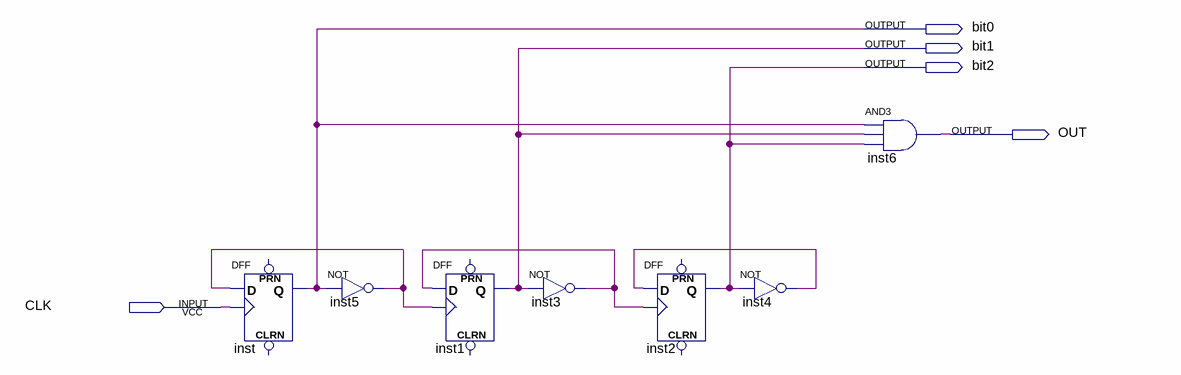
[diagram p0: schematic sheet]
// Quartus schematic Modulo8_Asyn_Counter.bdf as structural Verilog: 7 symbols, 5 pins
module Modulo8_Asyn_Counter (
  input  CLK,
  output bit0,
  output bit1,
  output bit2,
  output OUT
);

  wire inst3_out, inst4_out, inst5_out;

  DFF inst (.CLK(CLK), .D(inst5_out), .Q(bit0));  // open: CLRN, PRN
  not inst5 (inst5_out, bit0);
  DFF inst1 (.CLK(inst5_out), .D(inst3_out), .Q(bit1));  // open: CLRN, PRN
  not inst3 (inst3_out, bit1);
  DFF inst2 (.CLK(inst3_out), .D(inst4_out), .Q(bit2));  // open: CLRN, PRN
  not inst4 (inst4_out, bit2);
  and inst6 (OUT, bit0, bit1, bit2);
endmodule
